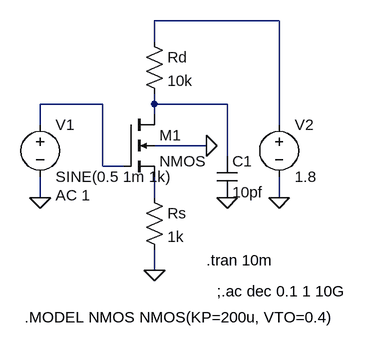
[diagram p0: schematic CS_withDE_RES.asc]
CS_withDE_RES.asc, the LTspice schematic file:
Version 4
SHEET 1 1904 1340
WIRE 464 -32 272 -32
WIRE 272 0 272 -32
WIRE 192 96 96 96
WIRE 272 96 272 80
WIRE 384 96 272 96
WIRE 272 112 272 96
WIRE 96 128 96 96
WIRE 464 128 464 -32
WIRE 352 160 272 160
WIRE 384 176 384 96
WIRE 192 192 192 96
WIRE 224 192 192 192
WIRE 96 240 96 208
WIRE 272 240 272 208
WIRE 464 240 464 208
WIRE 272 352 272 320
FLAG 96 240 0
FLAG 272 352 0
FLAG 464 240 0
FLAG 384 240 0
FLAG 352 160 0
SYMBOL voltage 96 112 R0
WINDOW 123 24 124 Left 2
WINDOW 39 0 0 Left 0
SYMATTR Value2 AC 1
SYMATTR InstName V1
SYMATTR Value SINE(0.5 1m 1k)
SYMBOL voltage 464 112 R0
WINDOW 123 0 0 Left 0
WINDOW 39 0 0 Left 0
SYMATTR InstName V2
SYMATTR Value 1.8
SYMBOL nmos4 224 112 R0
SYMATTR InstName M1
SYMBOL res 256 -16 R0
SYMATTR InstName Rd
SYMATTR Value 10k
SYMBOL res 256 224 R0
SYMATTR InstName Rs
SYMATTR Value 1k
SYMBOL cap 368 176 R0
SYMATTR InstName C1
SYMATTR Value 10pf
TEXT 352 336 Left 2 !.tran 10m
TEXT 72 424 Left 2 !.MODEL NMOS NMOS(KP=200u, VTO=0.4)
TEXT 368 384 Left 2 !;.ac dec 0.1 1 10G

The netlist it stands for:
* CS_withDE_RES.asc
V1 N002 0 SINE(0.5 1m 1k) AC 1
V2 N001 0 1.8
M1 N003 N002 N004 0 NMOS
Rd N001 N003 10k
Rs N004 0 1k
C1 N003 0 10pf
.model NMOS NMOS
.model PMOS PMOS
.lib standard.mos
.tran 10m
.MODEL NMOS NMOS(KP=200u, VTO=0.4)
;.ac dec 0.1 1 10G
.backanno
.end